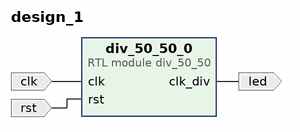
[diagram p0: block diagram of the top level]
# Vivado block design design_1, xc7a35tcpg236-1, Vivado 2026.1
create_bd_design design_1

create_bd_port -dir I -type clk clk
create_bd_port -dir O led
create_bd_port -dir I -type rst rst

create_bd_cell -type module -reference div_50_50 div_50_50_0

# ---- connections ----

connect_bd_net -net clk_0_1 [get_bd_ports clk] [get_bd_pins div_50_50_0/clk]
connect_bd_net [get_bd_pins div_50_50_0/clk_div] [get_bd_ports led]
connect_bd_net -net rst_0_1 [get_bd_ports rst] [get_bd_pins div_50_50_0/rst]

validate_bd_design
save_bd_design
